# EAGLE design modem2 (EAGLE 7.5.0)
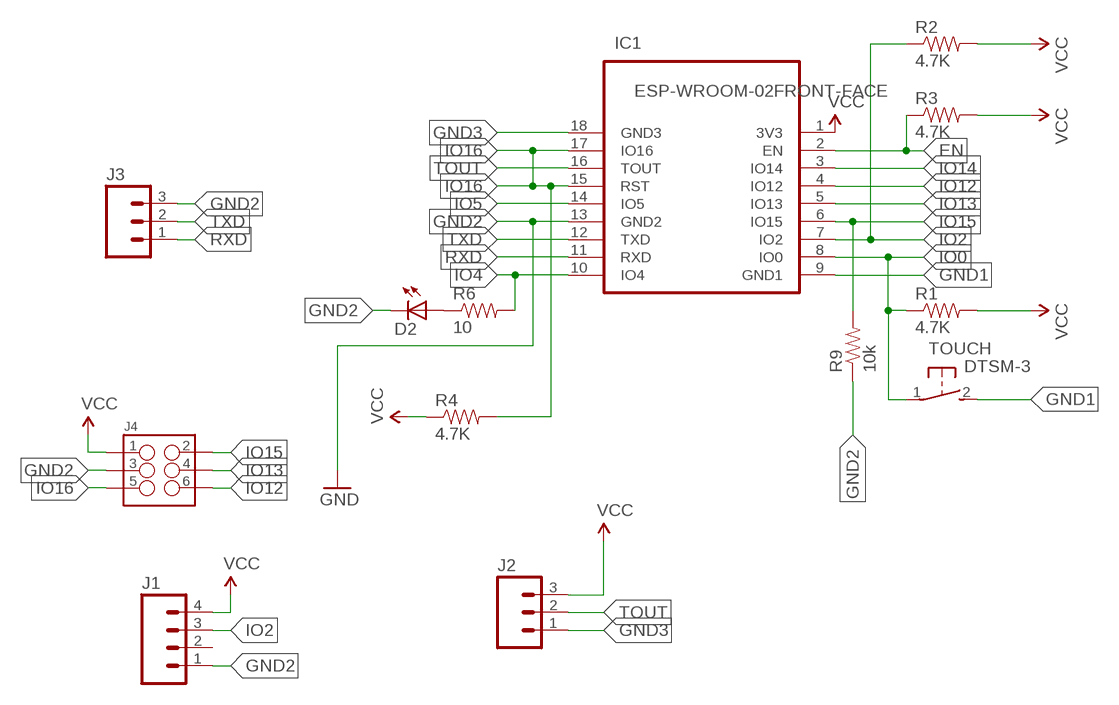
[diagram p0: schematic, sheet 1]

## Parts
D2  LEDCHIPLED_0805  [CHIPLED_0805]
IC1  ESP-WROOM-02FRONT-FACE  [FRONT-FACE]
J1  M04NO_SILK_ALL_ROUND  [1X04_NO_SILK_ALL_ROUND]
J2  M03PTH  [1X03]
J3  M031X03_NO_SILK  [1X03_NO_SILK]
J4  M03X2SHROUD  [2X3-SHROUDED]
R1  4.7K  RESISTOR0805-RES  [0805]
R2  4.7K  RESISTOR0805-RES  [0805]
R3  4.7K  RESISTOR0805-RES  [0805]
R4  4.7K  RESISTOR0805-RES  [0805]
R6  10  RESISTOR0805-RES  [0805]
R9  10k  RESISTOR0805-RES  [0805]
TOUCH  DTSM-3  [DTSM-3]

## Nets
EN: IC1.2(EN) R3.1
GND1: IC1.9(GND1) TOUCH.2
GND2: D2.C IC1.13(GND2) J1.1 J3.3 J4.3 R9.1 ; supply symbol labelled GND
GND3: IC1.18(GND3) J2.1
IO0: IC1.8(IO0) R1.1 TOUCH.1
IO2: IC1.7(IO2) J1.3 R2.1
IO4: IC1.10(IO4) R6.2
IO5: IC1.14(IO5)
IO12: IC1.4(IO12) J4.6
IO13: IC1.5(IO13) J4.4
IO14: IC1.3(IO14)
IO15: IC1.6(IO15) J4.2 R9.2
IO16: IC1.15(RST) IC1.17(IO16) J4.5 R4.2
N$2: D2.A R6.1
RXD: IC1.11(RXD) J3.1
TOUT: IC1.16(TOUT) J2.2
TXD: IC1.12(TXD) J3.2
VCC: IC1.1(3V3) J1.4 J2.3 J4.1 R1.2 R2.2 R3.2 R4.1
Unconnected: J1.2

## Library data of the parts
D2 = adafruit:LED: LED OSRAM: - CHIPLED LG R971, LG N971, LY N971, LG Q971, LY Q971, LO R971, LY R971 LH N974, LH R974 LS Q976, LO Q976, LY Q976 LO Q996 - Hyper CHIPLED LW Q18S LB Q993, LB Q99A, LB R99A - SideLED LS A670, LO A670, LY A670, LG A670, LP A670 LB A673, LV A673, LT A673, LW A673 LH A674 LY A675 LS A676, LA A676, LO A676, LY A676, LW A676 LS A679, LY A679, LG A679 - Hyper Micro SIDELED® LS Y876, LA Y876, LO Y876, LY Y876 LT Y87S - SmartLED LW L88C, LW L88S LB L89C, LB L89S, LG L890 LS L89K, LO L89K, LY L89K LS L896, LA L896, LO L896, LY L896 - TOPLED LS T670, LO T670, LY T670, LG T670, LP T670 LSG T670, LSP T670, LSY T670, LOP T670, LYG T670 LG T671, LOG T671, LSG T671 LB T673, LV T673, LT T673, LW T673 LH T674 LS T676, LA T676, LO T676, LY T676, LB T676, LH T676, LSB T676, LW T676 LB T67C, LV T67C, LT T67C, LS T67K, LO T67K, LY T67K, LW E67C LS E67B, LA E67B, LO E67B, LY E67B, LB E67C, LV E67C, LT E67C LW T67C LS T679, LY T679, LG T679 LS T770, LO T770, LY T770, LG T770, LP T770 LB T773, LV T773, LT T773, LW T773 LH T774 LS E675, LA E675, LY E675, LS T675 LS T776, LA T776, LO T776, LY T776, LB T776 LHGB T686 LT T68C, LB T68C - Hyper Mini TOPLED® LB M676 - Mini TOPLED Santana® LG M470 LS M47K, LO M47K, LY M47K Source: http://www.osram.convergy.de/
IC1 = esp-wroom-02:ESP-WROOM-02: WiFi module - ESP-WROOM-02
J1 = SparkFun-Connectors:M04: Header 4 Standard 4-pin 0.1" header. Use with straight break away headers (SKU : PRT-00116), right angle break away headers (PRT-00553), swiss pins (PRT-00743), machine pins (PRT-00117), and female headers (PRT-00115). Molex polarized connector foot print use with SKU : PRT-08231 with associated crimp pins and housings. 1MM SMD Version SKU: PRT-10208; PROD_ID: CONN-09696
J2 J3 = SparkFun-Connectors:M03: Header 3 Standard 3-pin 0.1" header. Use with straight break away headers (SKU : PRT-00116), right angle break away headers (PRT-00553), swiss pins (PRT-00743), machine pins (PRT-00117), and female headers (PRT-00115). Molex polarized connector foot print use with SKU : PRT-08232 with associated crimp pins and housings.
J4 = SparkFun-Connectors:M03X2: 2x3 .1" header. Shrouded, with keying- CONN-10681 SMT- CONN-11415 Pogo pins- HW-11044; PROD_ID: CONN-10681
R1-R4 R6 R9 = SparkFun-Passives:RESISTOR: Resistor Basic schematic elements and footprints for 0603, 1206, and PTH resistors.
TOUCH = switch-tact:DTSM-3

## Board
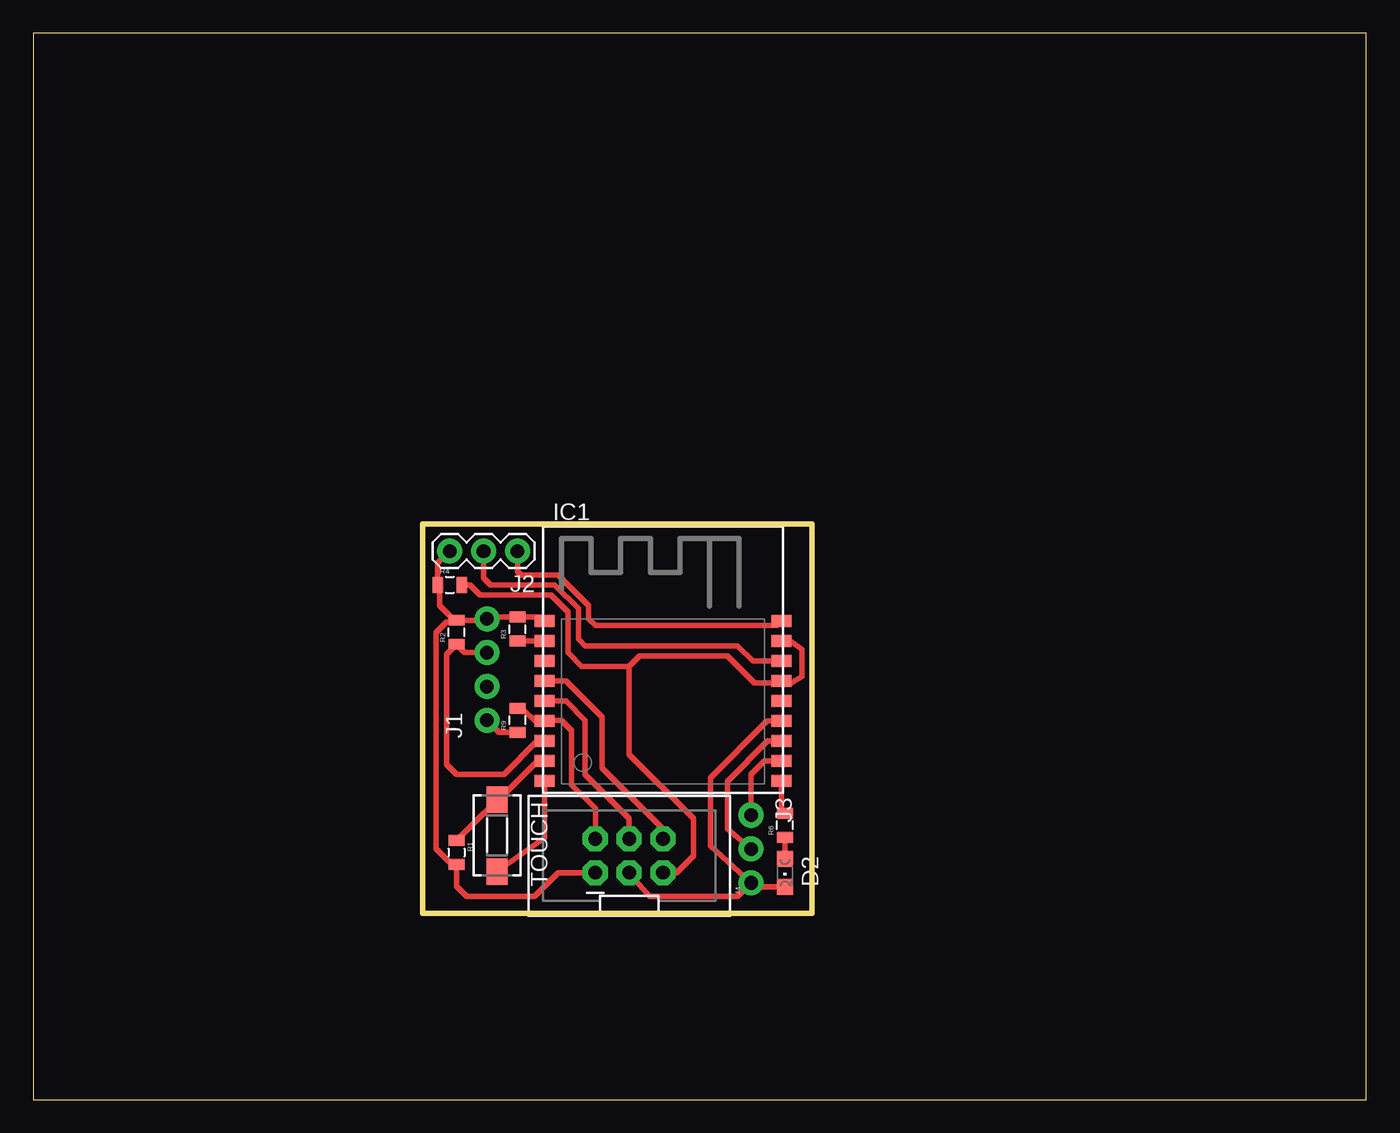
[diagram p1: board, top side]
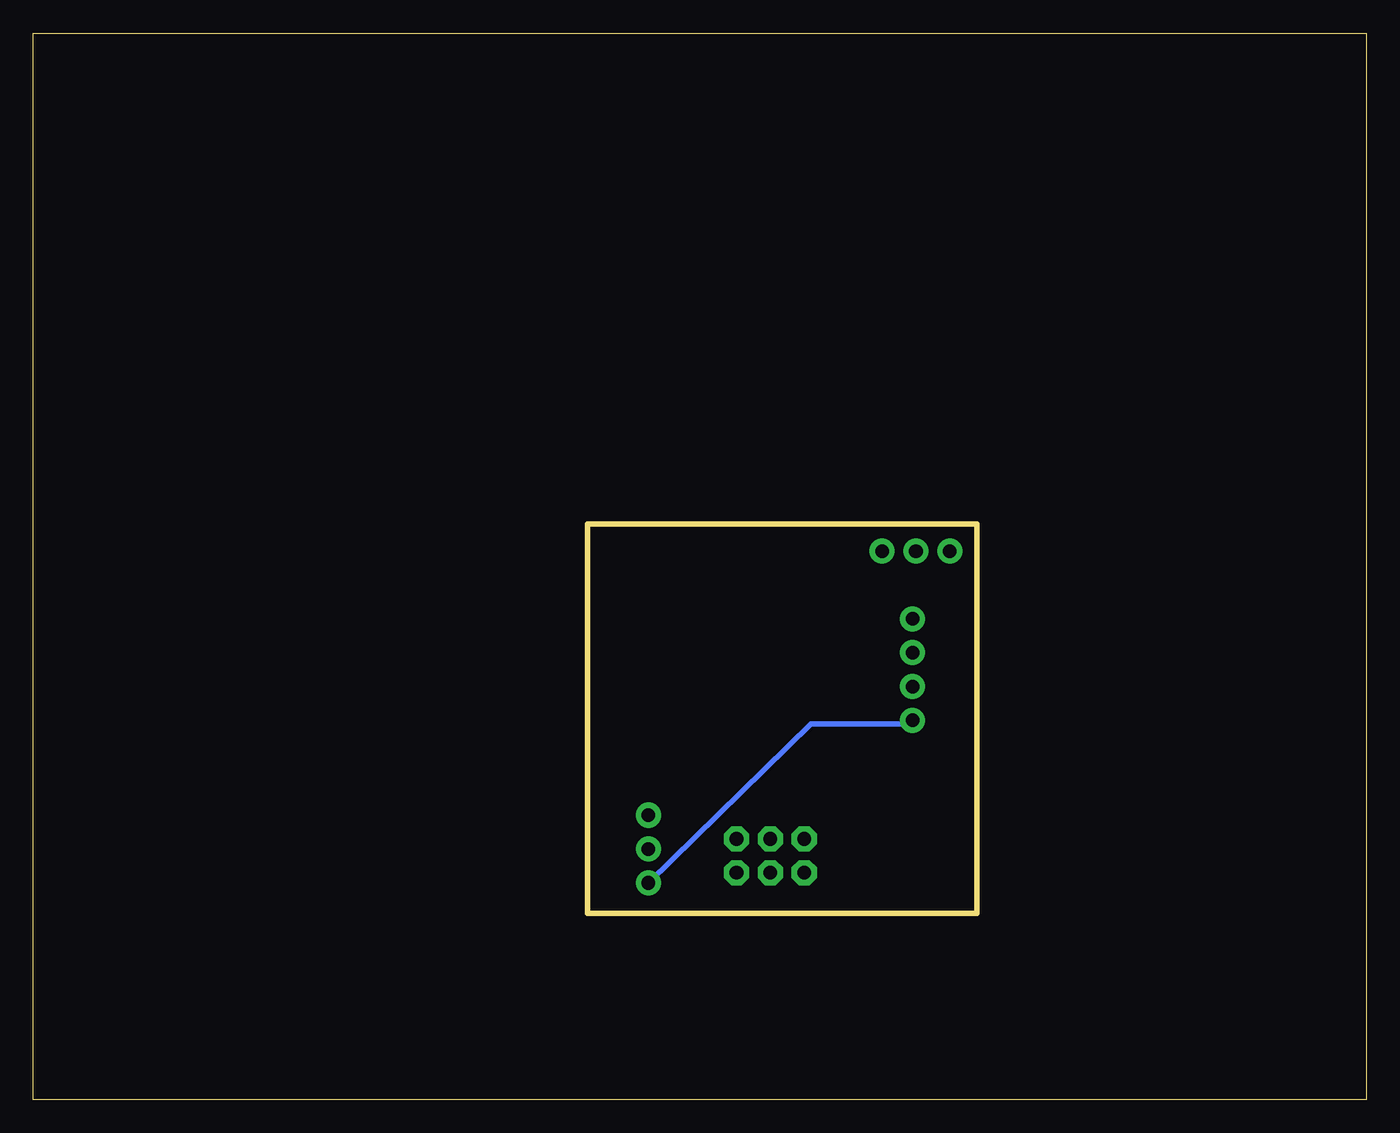
[diagram p2: board, bottom side, seen from below]

Size 100 x 80 mm. Coordinates in mm from the lower left corner, seen from the top.
Outline: 0,0 100,0 100,80 0,80 0,0
Outline: 58.42,43.18 58.42,13.97 29.21,13.97 29.21,43.18 58.42,43.18
Copper layers (1*16): Top 0.035mm / dielectric 1.5mm / Bottom 0.035mm
Design rules "default": minimum track width 10mil, minimum drill 24mil, track to track 8mil, track to pad 8mil, pad to pad 8mil, via to via 8mil, smd to smd 8mil, copper to edge 40mil, drill to drill 8mil, minimum pad ring 10mil, minimum via ring 8mil, stop-mask expansion 4mil, vias tented up to drill 0mil, thermal gap 10mil

### Footprints (pad centres in the part's own frame; a part is rotated, then mirrored left to right if it is on the bottom)
CHIPLED_0805 = smd 1.2 x 1.2: A 0,-1.05; C 0,1.05
FRONT-FACE = smd 1.485 x 0.9: 1 -8.893,4.9; 2 -8.893,3.4; 3 -8.893,1.9; 4 -8.893,0.4; 5 -8.893,-1.1; 6 -8.893,-2.6; 7 -8.893,-4.1; 8 -8.893,-5.6; 9 -8.893,-7.1; 10 8.893,-7.1; 11 8.893,-5.6; 12 8.893,-4.1; 13 8.893,-2.6; 14 8.893,-1.1; 15 8.893,0.4; 16 8.893,1.9; 17 8.893,3.4; 18 8.893,4.9
1X04_NO_SILK_ALL_ROUND = drill 1.016 pad 1.88: 1 0,0; 2 2.54,0; 3 5.08,0; 4 7.62,0
1X03 = drill 1.016 pad 1.88: 1 0,0; 2 2.54,0; 3 5.08,0
1X03_NO_SILK = drill 1.016 pad 1.88: 1 0,0; 2 2.54,0; 3 5.08,0
2X3-SHROUDED = drill 1.016 pad 1.88 octagon: 1 -1.27,2.54; 2 1.27,2.54; 3 -1.27,0; 4 1.27,0; 5 -1.27,-2.54; 6 1.27,-2.54
0805 = smd 0.8 x 1.2: 1 -0.9,0; 2 0.9,0
DTSM-3 = smd 2 x 1.6: 1 -2.7,0; 2 2.7,0

### Placement (x,y rotation side)
D2  56.39,17.02 180 top
IC1  47.24,30.99 0 top
J1  34.04,28.45 90 top
J2  36.32,41.15 180 top
J3  53.85,21.34 270 top
J4  44.7,18.29 90 top
R1  31.75,18.54 270 top
R2  31.75,35.05 90 top
R3  36.32,35.31 90 top
R4  31.24,38.61 0 top
R6  56.39,20.57 90 top
R9  36.32,28.45 90 top
TOUCH  34.8,19.81 270 top

### Tracks (layer width: path | path; a pad name or v marks a point on that pad's centre or on a via)
EN
  Top 0.406: IC1.2 36.34,34.39 R3.1
GND1
  Top 0.406: IC1.9 38.35,19.65 TOUCH.2
GND2
  Top 0.406: J4.3 46.23,15.24 52.83,15.24 J3.3 | IC1.13 55.06,28.39 50.8,24.13 50.8,19.05 J3.3 | D2.C 54.14,15.97 J3.3 | R9.1 34.94,27.55 J1.1
  Bottom 0.406: J3.3 41.66,28.19 34.29,28.19 J1.1
GND3
  Top 0.406: J2.1 36.32,39.62 36.58,39.37 39.37,39.37 41.66,37.08 41.66,36.07 42.16,35.56 55.81,35.56 IC1.18
IO0
  Top 0.406: IC1.8 37.83,25.39 34.8,22.35 TOUCH.1 33.8,21.5 R1.1
IO2
  Top 0.406: IC1.7 37.81,26.89 35.31,24.38 31.75,24.38 30.99,25.15 30.99,33.39 R2.1 32.37,33.53 J1.3
IO4
  Top 0.406: IC1.10 56.14,21.73 R6.2
IO12
  Top 0.406: IC1.4 39.99,31.39 42.67,28.7 42.67,24.89 47.24,20.32 J4.6
IO13
  Top 0.406: IC1.5 39.96,29.89 41.4,28.45 41.4,24.38 44.7,21.08 J4.4
IO15
  Top 0.406: J4.2 42.16,21.84 40.39,23.62 40.39,27.69 39.62,28.45 38.41,28.45 IC1.6 37.65,28.39 36.83,29.21 36.46,29.21 R9.2
IO16
  Top 0.406: J4.5 48.26,17.02 49.53,18.29 49.53,21.08 44.7,25.91 44.7,32.51 | 44.7,32.51 45.47,33.27 52.07,33.27 54.1,31.24 55.99,31.24 IC1.15 56.28,31.24 56.9,31.24 57.66,31.75 57.66,33.78 56.8,34.39 IC1.17 | R4.2 32.77,38.61 33.53,37.85 38.86,37.85 40.13,36.58 40.13,33.53 41.15,32.51 44.7,32.51
N$2
  Top 0.406: R6.1 D2.A
RXD
  Top 0.406: IC1.11 54.85,25.39 53.85,24.38 J3.1
TOUT
  Top 0.406: IC1.16 53.98,32.89 52.83,34.04 41.4,34.04 40.89,34.54 40.89,36.83 39.12,38.61 34.29,38.61 33.78,39.12 J2.2
TXD
  Top 0.406: IC1.12 55.08,26.89 52.07,23.88 52.07,20.32 J3.2
VCC
  Top 0.406: J4.1 39.37,17.02 37.59,15.24 32.51,15.24 31.75,16 R1.2 31.38,17.64 30.23,18.8 30.23,35.05 30.99,35.81 31.61,35.81 R2.2 | J2.3 30.34,40.25 R4.1 30.48,38.47 30.48,37.08 31.61,35.95 R2.2 | R2.2 33.92,35.95 J1.4 34.17,36.21 R3.2 38.03,36.21 IC1.1